# EAGLE schematic powersupply (EAGLE 5.10)
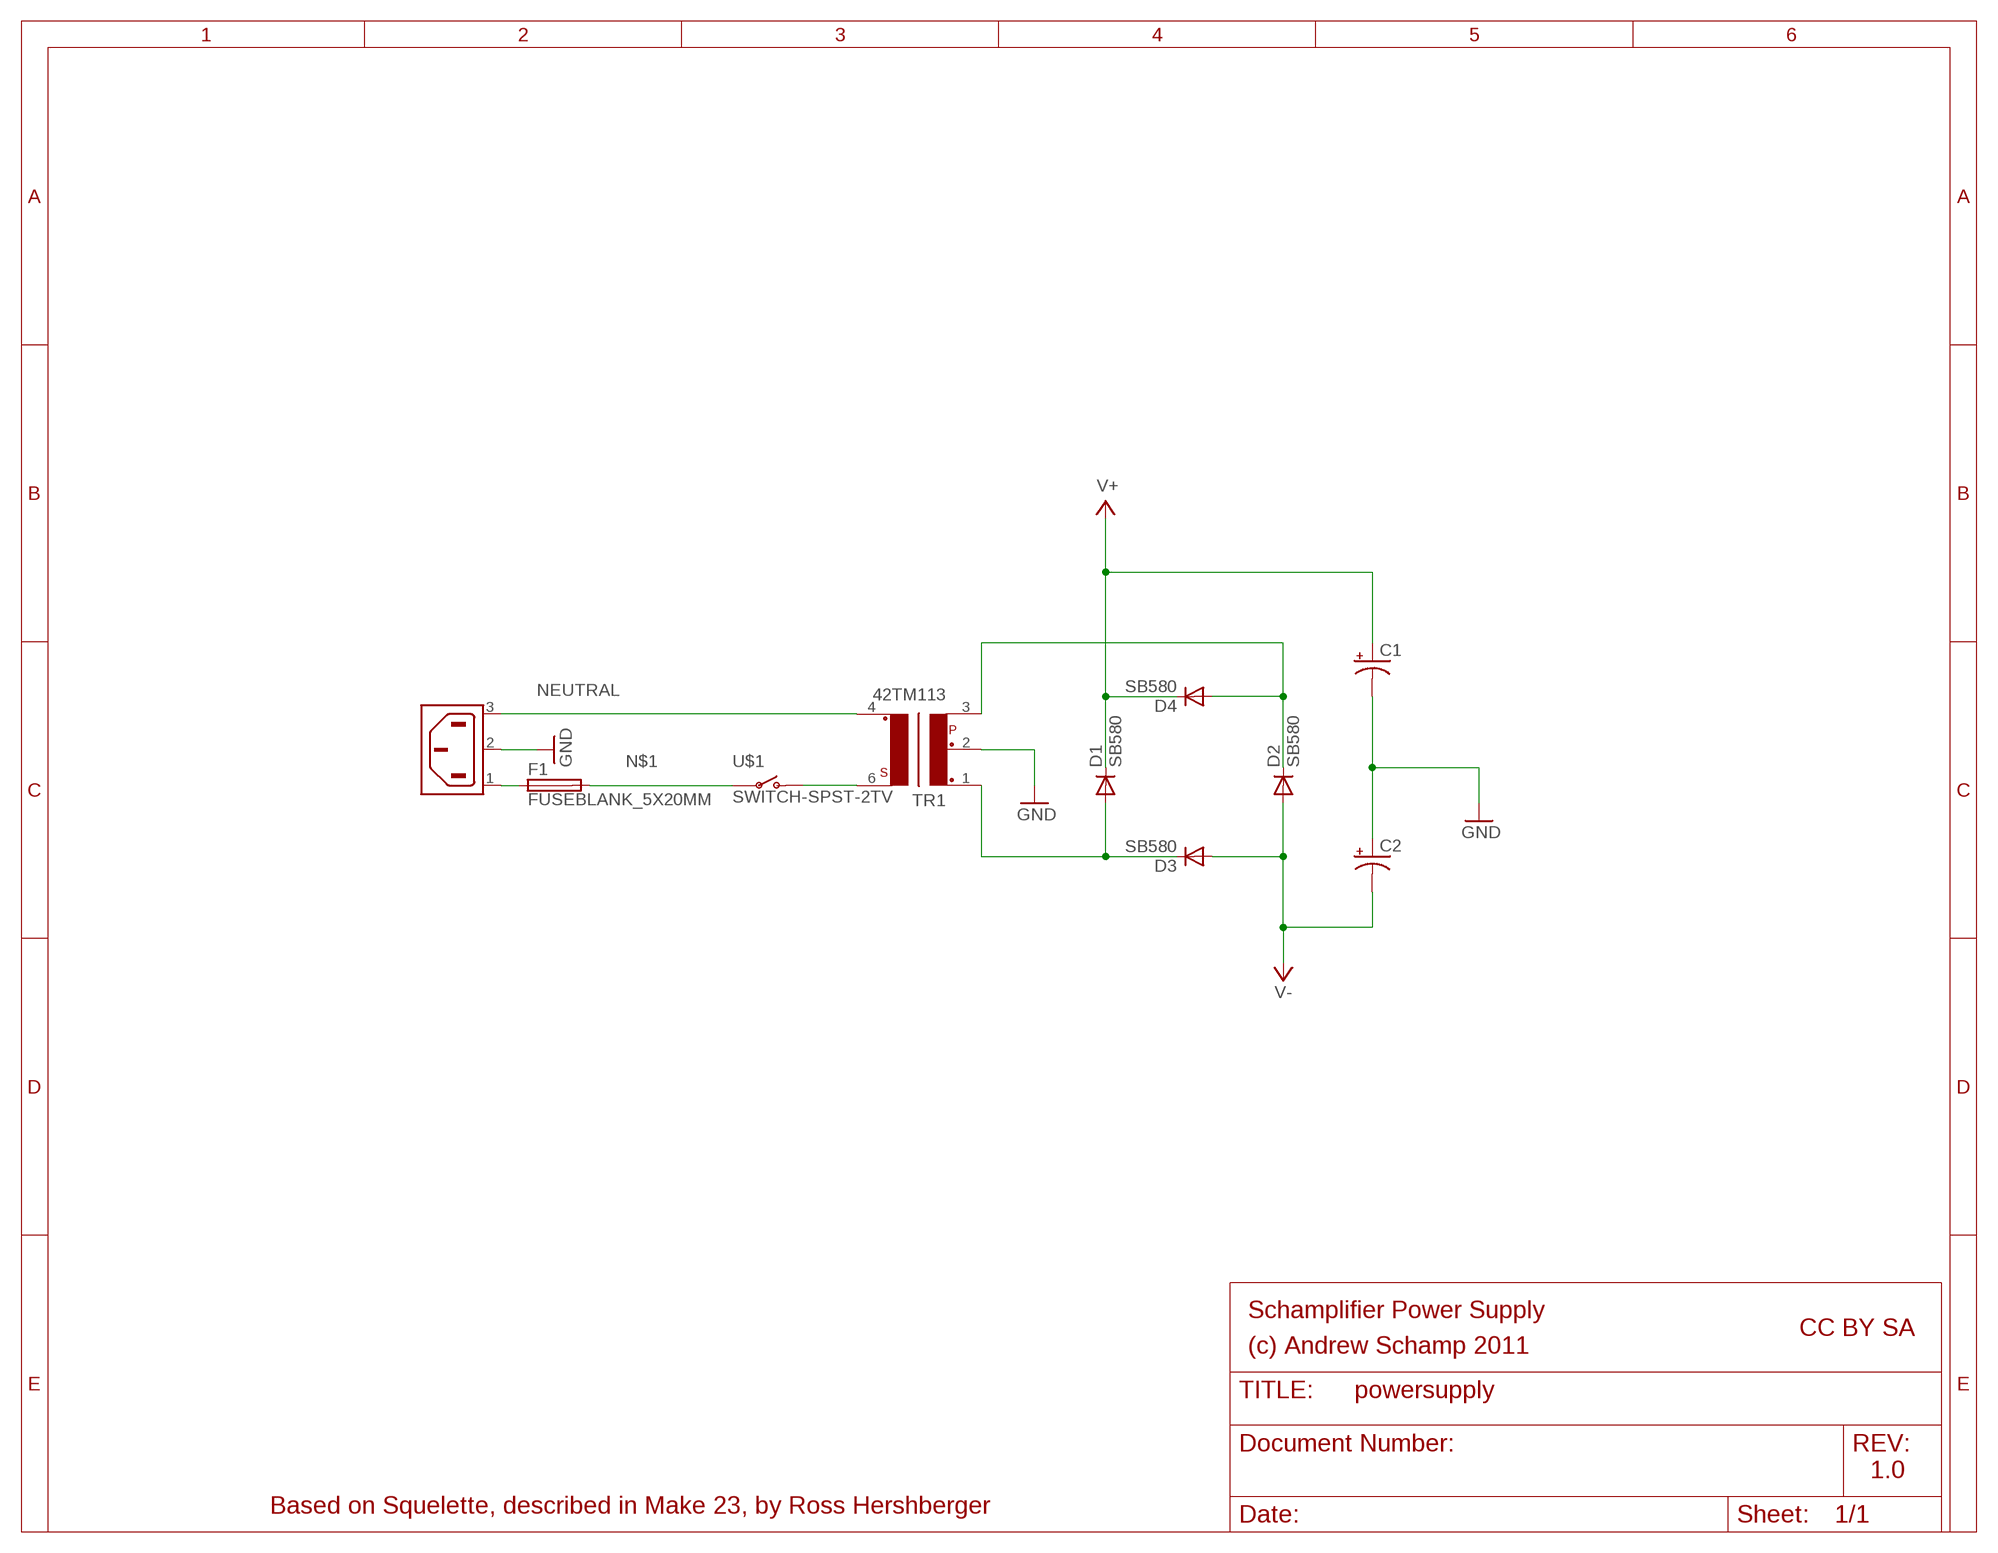
[diagram p0: schematic, sheet 1]

## Parts
C1  CPOL-USE7.5-16  [E7,5-16]
C2  CPOL-USE7.5-16  [E7,5-16]
D1  SB580  SB320  [DO201-15]
D2  SB580  SB320  [DO201-15]
D3  SB580  SB320  [DO201-15]
D4  SB580  SB320  [DO201-15]
F1  FUSEBLANK_5X20MM  [FUSE_HOLDER_5X20MM]
TR1  42TM113  [42TM]
U$1  SWITCH-SPST-2TV  [SWITCH-SPST-VERTICAL]
X1  6ESRM-P  [6ESRM-P]

## Nets
GND: C1.- C2.+ TR1.2 X1.2(SH)
N$1: F1.2 U$1.2(P)
N$2: TR1.6 U$1.1(O)
N$4: F1.1 X1.1(AC1)
N$6: D1.A D3.C TR1.1
N$8: D2.C D4.A TR1.3
NEUTRAL: TR1.4 X1.3(AC2)
V+: C1.+ D1.C D4.C
V-: C2.- D2.A D3.A

## Notes on the sheet
- Schamplifier Power Supply
- CC BY SA
- (c) Andrew Schamp 2011
- 1.0
- Based on Squelette, described in Make 23, by Ross Hershberger

## Library data of the parts
C1 C2 = resistor:CPOL-US: POLARIZED CAPACITOR, American symbol
D1-D4 = diode:SB320: DIODE barrier rectifier, 3 A (Fairchild)
F1 = fuse:FUSE: Fuse
TR1 = trafo-xicon:42TM113: Transformer Mouser 42TLM Series Source: http://www.mouser.com/catalog/specsheets/164267.pdf
U$1 = SparkFun:SWITCH-SPST-2
X1 = con-tycoelectronics:6ESRM-P: AC Connector 120/250 VAC Source: http://catalog.tycoelectronics.com .. ENG_DS_1654001_1099_SR_0406.pdf